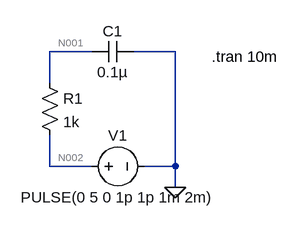
[diagram p0: schematic RC Circuit.asc]
RC Circuit.asc, the LTspice schematic file:
Version 4
SHEET 1 880 680
WIRE 144 -16 80 -16
WIRE 272 -16 208 -16
WIRE 80 32 80 -16
WIRE 80 160 80 112
WIRE 144 160 80 160
WIRE 272 160 272 -16
WIRE 272 160 224 160
WIRE 272 192 272 160
FLAG 272 192 0
SYMBOL res 64 16 R0
SYMATTR InstName R1
SYMATTR Value 1k
SYMBOL cap 208 -32 R90
WINDOW 0 0 32 VBottom 2
WINDOW 3 32 32 VTop 2
SYMATTR InstName C1
SYMATTR Value 0.1µ
SYMBOL voltage 128 160 R270
WINDOW 0 32 56 VTop 2
WINDOW 3 -32 56 VBottom 2
WINDOW 123 0 0 Left 0
WINDOW 39 0 0 Left 0
SYMATTR InstName V1
SYMATTR Value PULSE(0 5 0 1p 1p 1m 2m)
TEXT 328 -8 Left 2 !.tran 10m

The netlist it stands for:
* RC Circuit.asc
R1 N001 N002 1k
C1 0 N001 0.1µ
V1 N002 0 PULSE(0 5 0 1p 1p 1m 2m)
.tran 10m
.backanno
.end

* Results of the author's LTspice run, read from the files saved beside the schematic
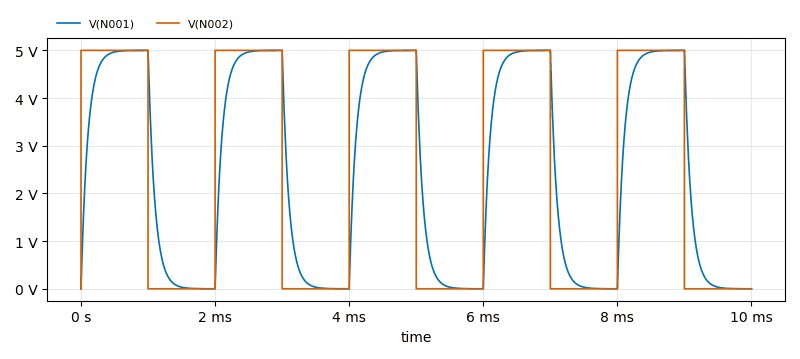
[diagram p1: Transient Analysis of RC Circuit.asc, plotted from the saved traces]
* Transient Analysis, 1 run:
*   V(N001): min 0 V, max 5 V, average 2.501 V, rms 3.356 V, last 225.2 µV
*   V(N002): min 0 V, max 5 V, average 2.5 V, rms 3.536 V, last 0 V